# EAGLE schematic MD2017_Space (EAGLE 6.2)
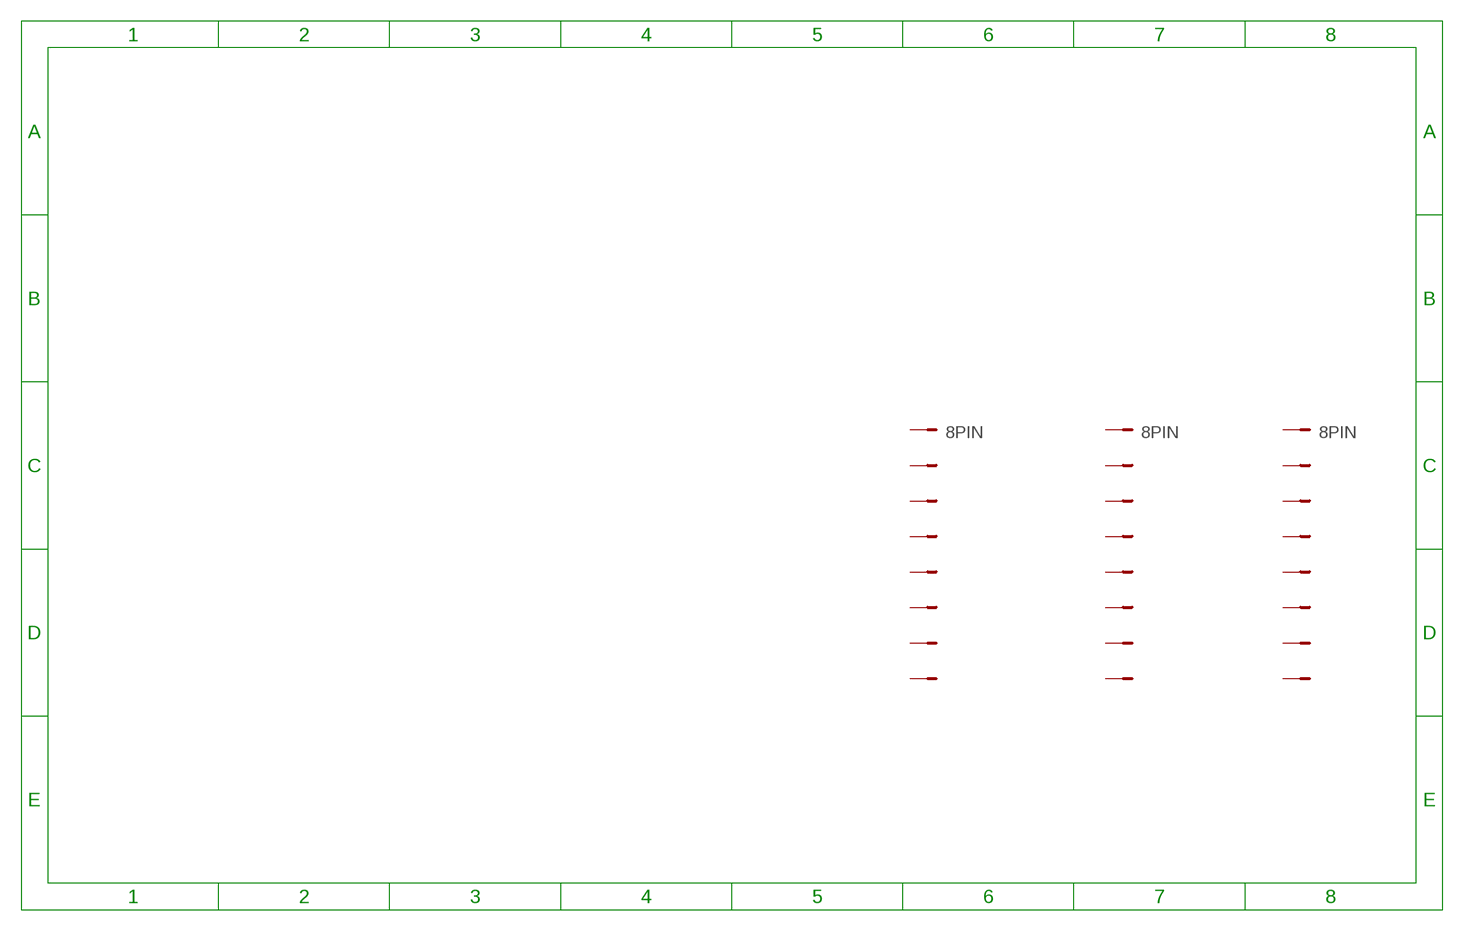
[diagram p0: schematic, sheet 1]

## Parts
POWERNPORT  8PIN  [FH105-1X8SG]
POWERPPORT  8PIN  [FH105-1X8SG]
SIGNALPORT  8PIN  [FH105-1X8SG]
Unconnected: POWERNPORT.1 POWERNPORT.2 POWERNPORT.3 POWERNPORT.4 POWERNPORT.5 POWERNPORT.6 POWERNPORT.7 POWERNPORT.8 POWERPPORT.1 POWERPPORT.2 POWERPPORT.3 POWERPPORT.4 POWERPPORT.5 POWERPPORT.6 POWERPPORT.7 POWERPPORT.8 SIGNALPORT.1 SIGNALPORT.2 SIGNALPORT.3 SIGNALPORT.4 SIGNALPORT.5 SIGNALPORT.6 SIGNALPORT.7 SIGNALPORT.8

## Library data of the parts
POWERNPORT POWERPPORT SIGNALPORT = FH105:8PIN